# EAGLE design lcd (EAGLE 8.5.0)
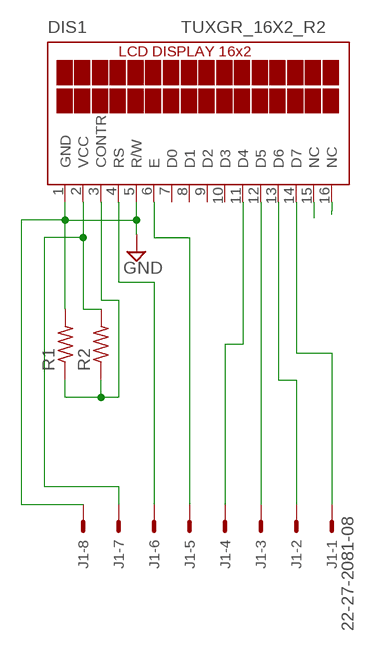
[diagram p0: schematic, sheet 1]

## Parts
DIS1  TUXGR_16X2_R2  [TUXGR_16X2_R2]
J1  22-27-2081-08  [6410-08]
R1  R-US_0207/10  [0207/10]
R2  R-US_0207/10  [0207/10]

## Nets
GND: DIS1.1(GND) DIS1.5(R/W) DIS1.16(NC) J1.8 R1.2
N$2: DIS1.3(CONTR) R1.1 R2.1
N$3: DIS1.11(D4) J1.4
N$4: DIS1.12(D5) J1.3
N$6: DIS1.14(D7) J1.1
N$7: DIS1.13(D6) J1.2
N$8: DIS1.6(E) J1.5
N$9: DIS1.4(RS) J1.6
VCC: DIS1.2(VCC) DIS1.15(NC) J1.7 R2.2
Unconnected: DIS1.7(D0) DIS1.8(D1) DIS1.9(D2) DIS1.10(D3)

## Library data of the parts
DIS1 = display-lcd:TUXGR_16X2_R2: Tuxgraphics LCD display 16x2 characters reflective, without background light Source: tuxgr_12x2_r2.pdf; OC_FARNELL: unknown; OC_NEWARK: unknown
J1 = con-molex:22-?-08: CONNECTOR wire to board 2.54 mm (.1 inch) pitch header; OC_FARNELL: unknown; OC_NEWARK: unknown
R1 R2 = rcl:R-US_: RESISTOR, American symbol

## Board
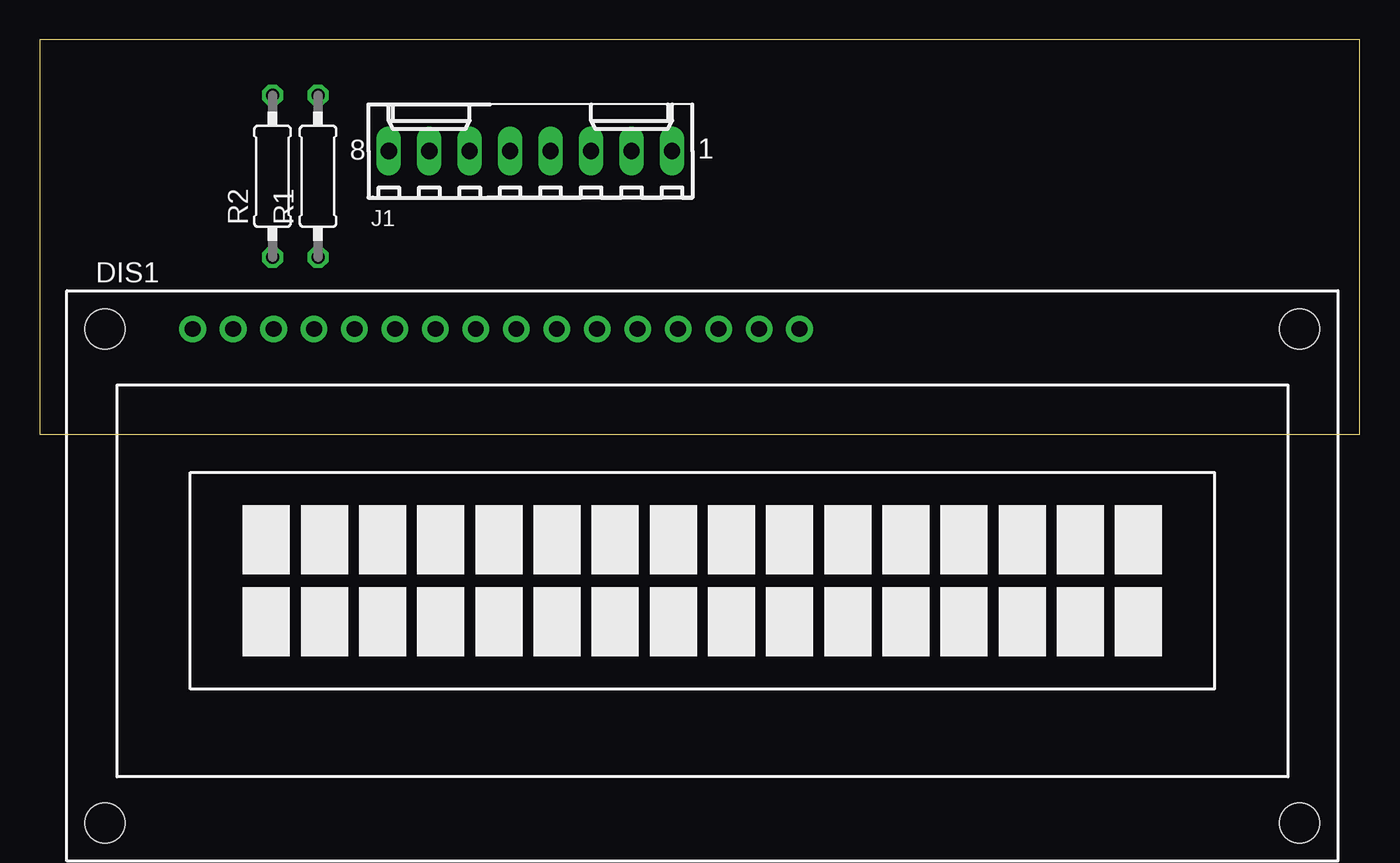
[diagram p1: board, top side]
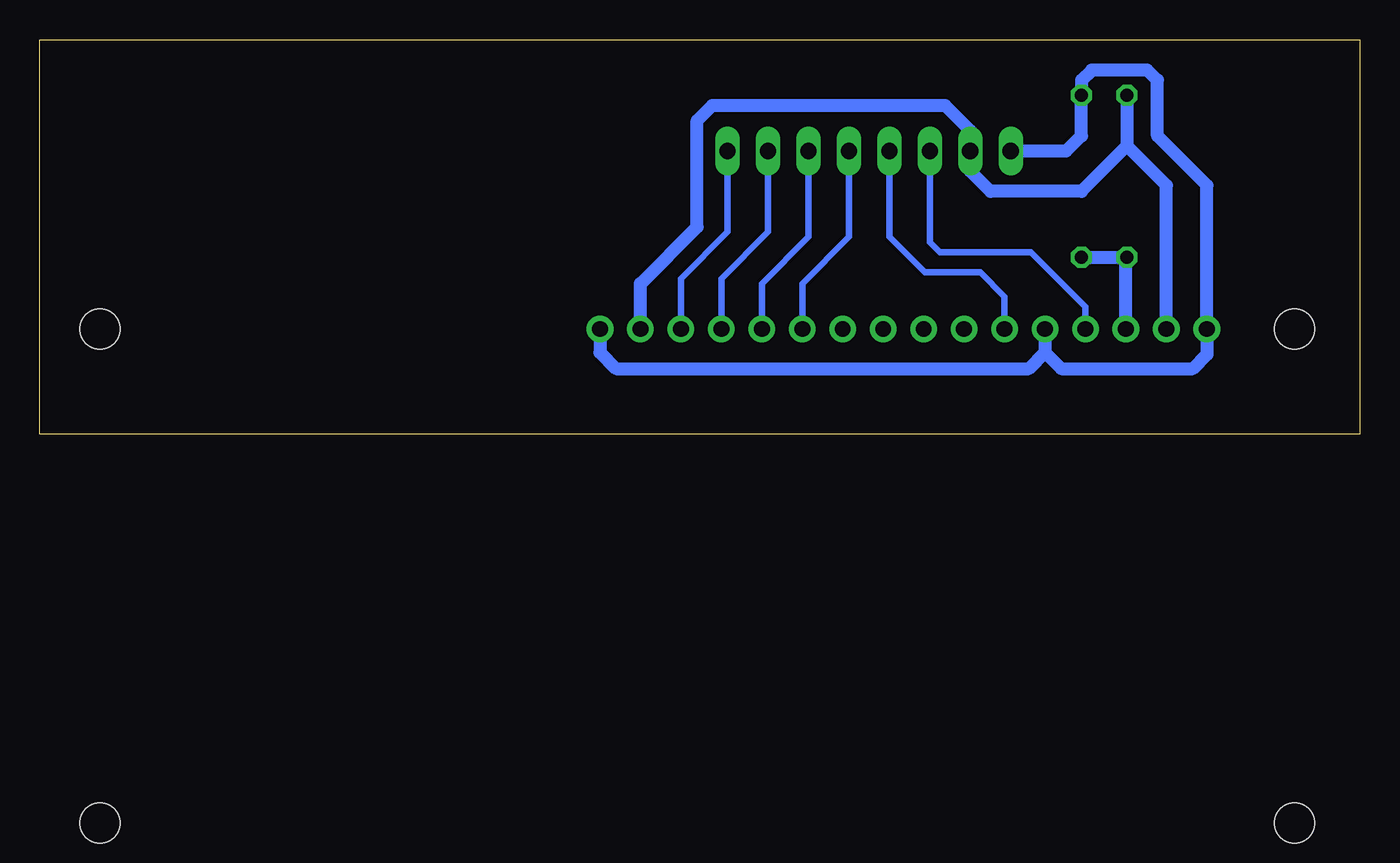
[diagram p2: board, bottom side, seen from below]

Size 82.86 x 24.75 mm. Coordinates in mm from the lower left corner, seen from the top.
Outline: 0,0 82.86,0 82.86,24.75 0,24.75 0,0
Copper layers (1*16): Top 0.035mm / dielectric 1.5mm / Bottom 0.035mm
Design rules "default": minimum track width 10mil, minimum drill 24mil, track to track 8mil, track to pad 8mil, pad to pad 8mil, via to via 8mil, smd to smd 8mil, copper to edge 40mil, drill to drill 8mil, minimum pad ring 10mil, minimum via ring 8mil, stop-mask expansion 4mil, vias tented up to drill 0mil, thermal gap 10mil

### Footprints (pad centres in the part's own frame; a part is rotated, then mirrored left to right if it is on the bottom)
TUXGR_16X2_R2 = drill 1 pad 1.676: 1 -32,15.5; 2 -29.46,15.5; 3 -26.92,15.5; 4 -24.38,15.5; 5 -21.84,15.5; 6 -19.3,15.5; 7 -16.76,15.5; 8 -14.22,15.5; 9 -11.68,15.5; 10 -9.14,15.5; 11 -6.6,15.5; 12 -4.06,15.5; 13 -1.52,15.5; 14 1.02,15.5; 15 3.56,15.5; 16 6.1,15.5 | hole 2.5: -37.5,-15.5; 37.5,-15.5; -37.5,15.5; 37.5,15.5
6410-08 = drill 1.016 long: 1 8.89,0; 2 6.35,0; 3 3.81,0; 4 1.27,0; 5 -1.27,0; 6 -3.81,0; 7 -6.35,0; 8 -8.89,0
0207/10 = drill 0.813 octagon: 1 -5.08,0; 2 5.08,0

### Placement (x,y rotation side)
DIS1  41.59,-8.89 0 top
J1  30.8,17.78 0 top
R1  17.46,16.19 90 top
R2  14.61,16.19 90 top

### Tracks (layer width: path | path; a pad name or v marks a point on that pad's centre or on a via)
GND
  Bottom 0.813: DIS1.5 19.75,5.15 | 19.75,5.15 18.73,4.13 10.48,4.13 9.59,5.01 DIS1.1 9.59,15.62 12.7,18.73 12.7,22.23 13.34,22.86 16.83,22.86 17.46,22.23 R1.2 17.46,18.73 18.41,17.78 J1.8 | DIS1.16 47.69,5.15 46.67,4.13 20.77,4.13 19.75,5.15
N$2
  Bottom 0.406: 14.67,11.04 R2.1
  Bottom 0.813: DIS1.3 14.67,11.04 | R1.1 R2.1
N$3
  Bottom 0.406: J1.4 32.07,12.38 34.99,9.46 DIS1.11
N$4
  Bottom 0.406: J1.3 34.61,12.38 37.53,9.46 DIS1.12
N$6
  Bottom 0.406: J1.1 39.69,12.7 42.61,9.78 DIS1.14
N$7
  Bottom 0.406: J1.2 37.15,12.7 40.07,9.78 DIS1.13
N$8
  Bottom 0.406: J1.5 29.53,12.38 27.3,10.16 23.81,10.16 22.29,8.64 DIS1.6
N$9
  Bottom 0.406: J1.6 26.99,12.06 26.35,11.43 20.64,11.43 17.21,8.01 DIS1.4
VCC
  Bottom 0.406: 24.45,16.51 24.45,17.14 | 24.45,19.05 J1.7
  Bottom 0.813: DIS1.2 12.13,15.62 14.61,18.1 | R2.2 14.61,18.1 | 14.61,18.1 17.46,15.24 23.18,15.24 24.45,16.51 | 24.45,17.14 J1.7 | DIS1.15 45.15,9.46 41.59,13.02 41.59,19.68 40.64,20.64 26.04,20.64 24.45,19.05